# Altium schematic sheet RevisionHistory.SchDoc: Iris
size A3; Organization: Toradex AG; Address1: Altsagenstrasse 5; Address2: Horw; Address3: 6048; Address4: Switzerland; DocumentNumber: 1; Revision: V2.0; SheetNumber: 1; SheetTotal: 16
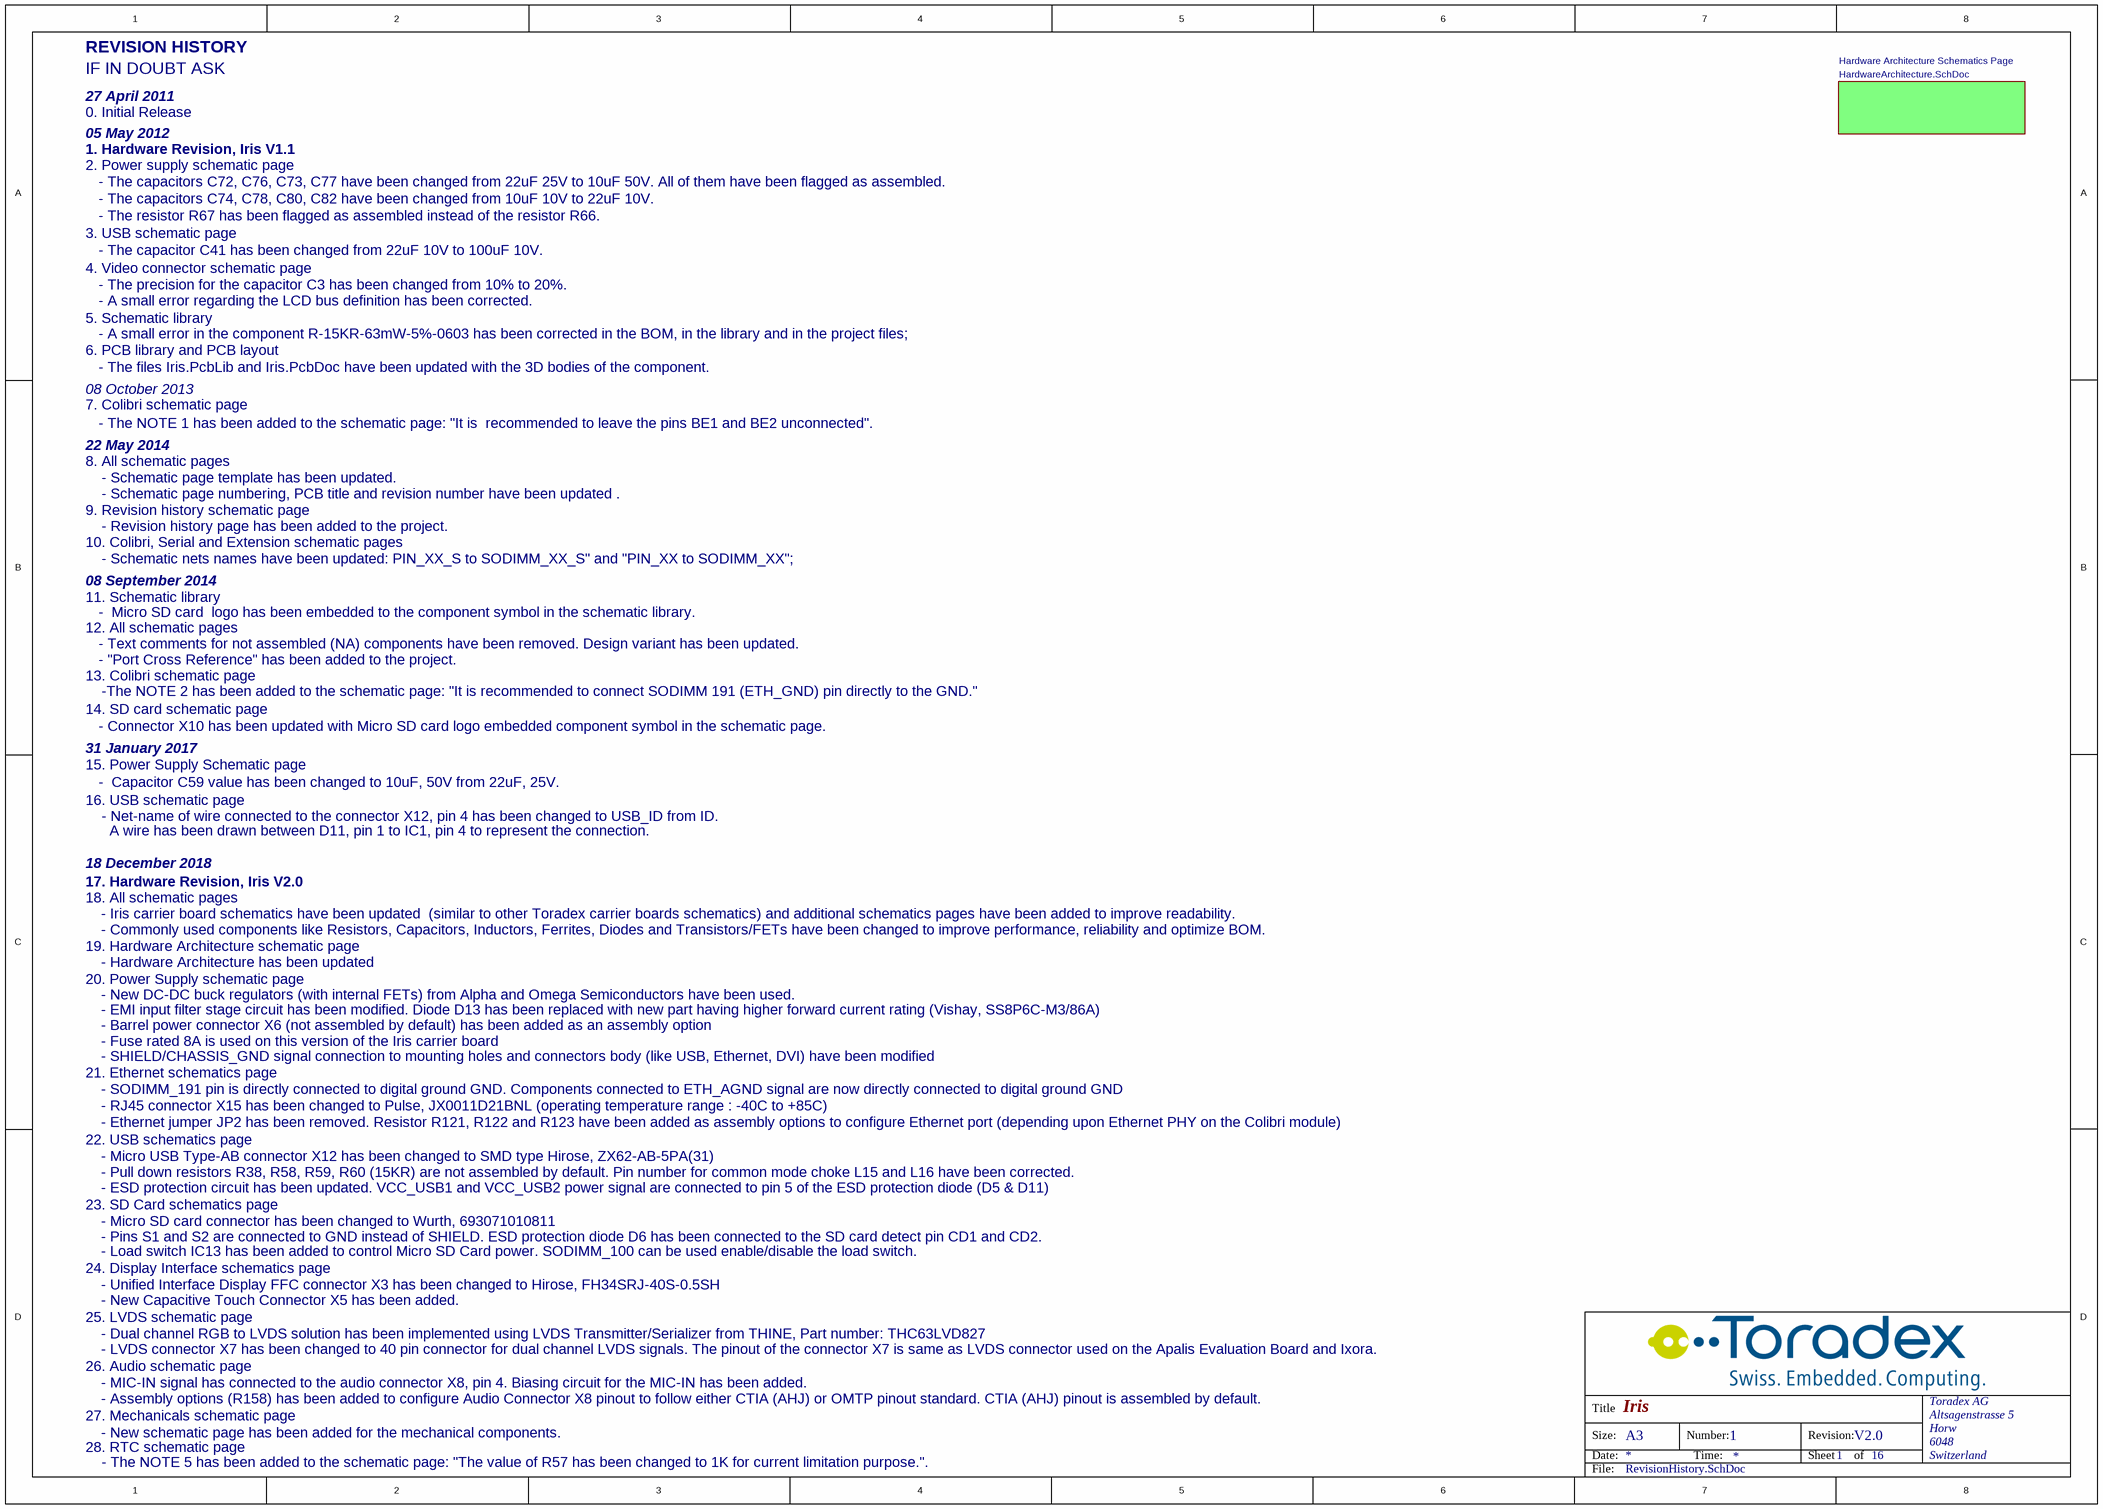
[diagram p0: RevisionHistory.SchDoc]

## Sub-sheets
Hardware Architecture Schematics Page = HardwareArchitecture.SchDoc: no entries

## Notes on the sheet
- REVISION HISTORY
- IF IN DOUBT ASK
- 27 April 2011
- 0. Initial Release
- 1. Hardware Revision, Iris V1.1
- 05 May 2012
- 2. Power supply schematic page
- 3. USB schematic page
- - The resistor R67 has been flagged as assembled instead of the resistor R66.
- - The capacitors C74, C78, C80, C82 have been changed from 10uF 10V to 22uF 10V.
- - The capacitors C72, C76, C73, C77 have been changed from 22uF 25V to 10uF 50V. All of them have been flagged as assembled.
- 4. Video connector schematic page
- - The capacitor C41 has been changed from 22uF 10V to 100uF 10V.
- - The precision for the capacitor C3 has been changed from 10% to 20%.
- - A small error regarding the LCD bus definition has been corrected.
- 5. Schematic library
- 6. PCB library and PCB layout
- - The files Iris.PcbLib and Iris.PcbDoc have been updated with the 3D bodies of the component.
- - A small error in the component R-15KR-63mW-5%-0603 has been corrected in the BOM, in the library and in the project files;
- 7. Colibri schematic page
- 08 October 2013
- 22 May 2014
- - The NOTE 1 has been added to the schematic page: "It is  recommended to leave the pins BE1 and BE2 unconnected".
- 8. All schematic pages
- 9. Revision history schematic page
- - Schematic page template has been updated.
- - Schematic page numbering, PCB title and revision number have been updated .
- 10. Colibri, Serial and Extension schematic pages
- 08 September 2014
- - Revision history page has been added to the project.
- - Schematic nets names have been updated: PIN_XX_S to SODIMM_XX_S" and "PIN_XX to SODIMM_XX";
- 12. All schematic pages
- 11. Schematic library
- - Text comments for not assembled (NA) components have been removed. Design variant has been updated.
- -  Micro SD card  logo has been embedded to the component symbol in the schematic library.
- 14. SD card schematic page
- 13. Colibri schematic page
- - "Port Cross Reference" has been added to the project.
- -The NOTE 2 has been added to the schematic page: "It is recommended to connect SODIMM 191 (ETH_GND) pin directly to the GND."
- 31 January 2017
- 15. Power Supply Schematic page
- - Connector X10 has been updated with Micro SD card logo embedded component symbol in the schematic page.
- -  Capacitor C59 value has been changed to 10uF, 50V from 22uF, 25V.
- 16. USB schematic page
- - Net-name of wire connected to the connector X12, pin 4 has been changed to USB_ID from ID.
- A wire has been drawn between D11, pin 1 to IC1, pin 4 to represent the connection.
- 17. Hardware Revision, Iris V2.0
- 18 December 2018
- 18. All schematic pages
- - Iris carrier board schematics have been updated  (similar to other Toradex carrier boards schematics) and additional schematics pages have been added to improve readability.
- 20. Power Supply schematic page
- 19. Hardware Architecture schematic page
- - Commonly used components like Resistors, Capacitors, Inductors, Ferrites, Diodes and Transistors/FETs have been changed to improve performance, reliability and optimize BOM.
- - Hardware Architecture has been updated
- - Fuse rated 8A is used on this version of the Iris carrier board
- - Barrel power connector X6 (not assembled by default) has been added as an assembly option
- - New DC-DC buck regulators (with internal FETs) from Alpha and Omega Semiconductors have been used.
- - EMI input filter stage circuit has been modified. Diode D13 has been replaced with new part having higher forward current rating (Vishay, SS8P6C-M3/86A)
- 21. Ethernet schematics page
- - SODIMM_191 pin is directly connected to digital ground GND. Components connected to ETH_AGND signal are now directly connected to digital ground GND
- - RJ45 connector X15 has been changed to Pulse, JX0011D21BNL (operating temperature range : -40C to +85C)
- - Ethernet jumper JP2 has been removed. Resistor R121, R122 and R123 have been added as assembly options to configure Ethernet port (depending upon Ethernet PHY on the Colibri module)
- - SHIELD/CHASSIS_GND signal connection to mounting holes and connectors body (like USB, Ethernet, DVI) have been modified
- 22. USB schematics page
- - Micro USB Type-AB connector X12 has been changed to SMD type Hirose, ZX62-AB-5PA(31)
- - Pull down resistors R38, R58, R59, R60 (15KR) are not assembled by default. Pin number for common mode choke L15 and L16 have been corrected.
- - ESD protection circuit has been updated. VCC_USB1 and VCC_USB2 power signal are connected to pin 5 of the ESD protection diode (D5 & D11)
- 23. SD Card schematics page
- - Micro SD card connector has been changed to Wurth, 693071010811
- - Pins S1 and S2 are connected to GND instead of SHIELD. ESD protection diode D6 has been connected to the SD card detect pin CD1 and CD2.
- - Load switch IC13 has been added to control Micro SD Card power. SODIMM_100 can be used enable/disable the load switch.
- 24. Display Interface schematics page
- 25. LVDS schematic page
- - Unified Interface Display FFC connector X3 has been changed to Hirose, FH34SRJ-40S-0.5SH
- - New Capacitive Touch Connector X5 has been added.
- 26. Audio schematic page
- - Dual channel RGB to LVDS solution has been implemented using LVDS Transmitter/Serializer from THINE, Part number: THC63LVD827
- - LVDS connector X7 has been changed to 40 pin connector for dual channel LVDS signals. The pinout of the connector X7 is same as LVDS connector used on the Apalis Evaluation Board and Ixora.
- - MIC-IN signal has connected to the audio connector X8, pin 4. Biasing circuit for the MIC-IN has been added.
- 27. Mechanicals schematic page
- 28. RTC schematic page
- - New schematic page has been added for the mechanical components.
- - Assembly options (R158) has been added to configure Audio Connector X8 pinout to follow either CTIA (AHJ) or OMTP pinout standard. CTIA (AHJ) pinout is assembled by default.
- - The NOTE 5 has been added to the schematic page: "The value of R57 has been changed to 1K for current limitation purpose.".
- Title
- Size:
- Date:
- A3
- Number:
- Time:
- Revision:
- Sheet
- of
- File: